# EAGLE schematic Janus v2 (EAGLE 7.4.0)
AUTHOR: Jordan Jones; DESCRIPT: Single Two Input XOR Single One Input NOT 555 Timer Quad Two Input AND; DEVICE: CAPACITOR CAPACITOR 1N4148X-TP TLP152 TLP152 TLP152 DMN6140L-7 DMN6140L-7 RESISTOR RESISTOR RESISTOR RESISTOR 74LVC1G86W5-7 74HCT1G14GW,125 NE555S-13DICT-ND SN74LV08APWR; DOCNUM: 1; ORGANIZATION: CAL POLY IGVC; PACKAGE: C0603 C0603 SOD523_SC79 SOIC-6-5 SOIC-6-5 SOIC-6-5 SOT-23 SOT-23 R0603 R0603 R0603 R0603 SOT-25 SOT-353 SO-8 TSSOP-14; PARTS: C1 C2 D1 OK1 OK2 OK3 Q1 Q2 R1 R2 R3 R4 U1 U2 U3 U4; PARTVAL: .01uF 100nF 330ohm 330ohm 330ohm 1Mohm; REV: 1.0.1
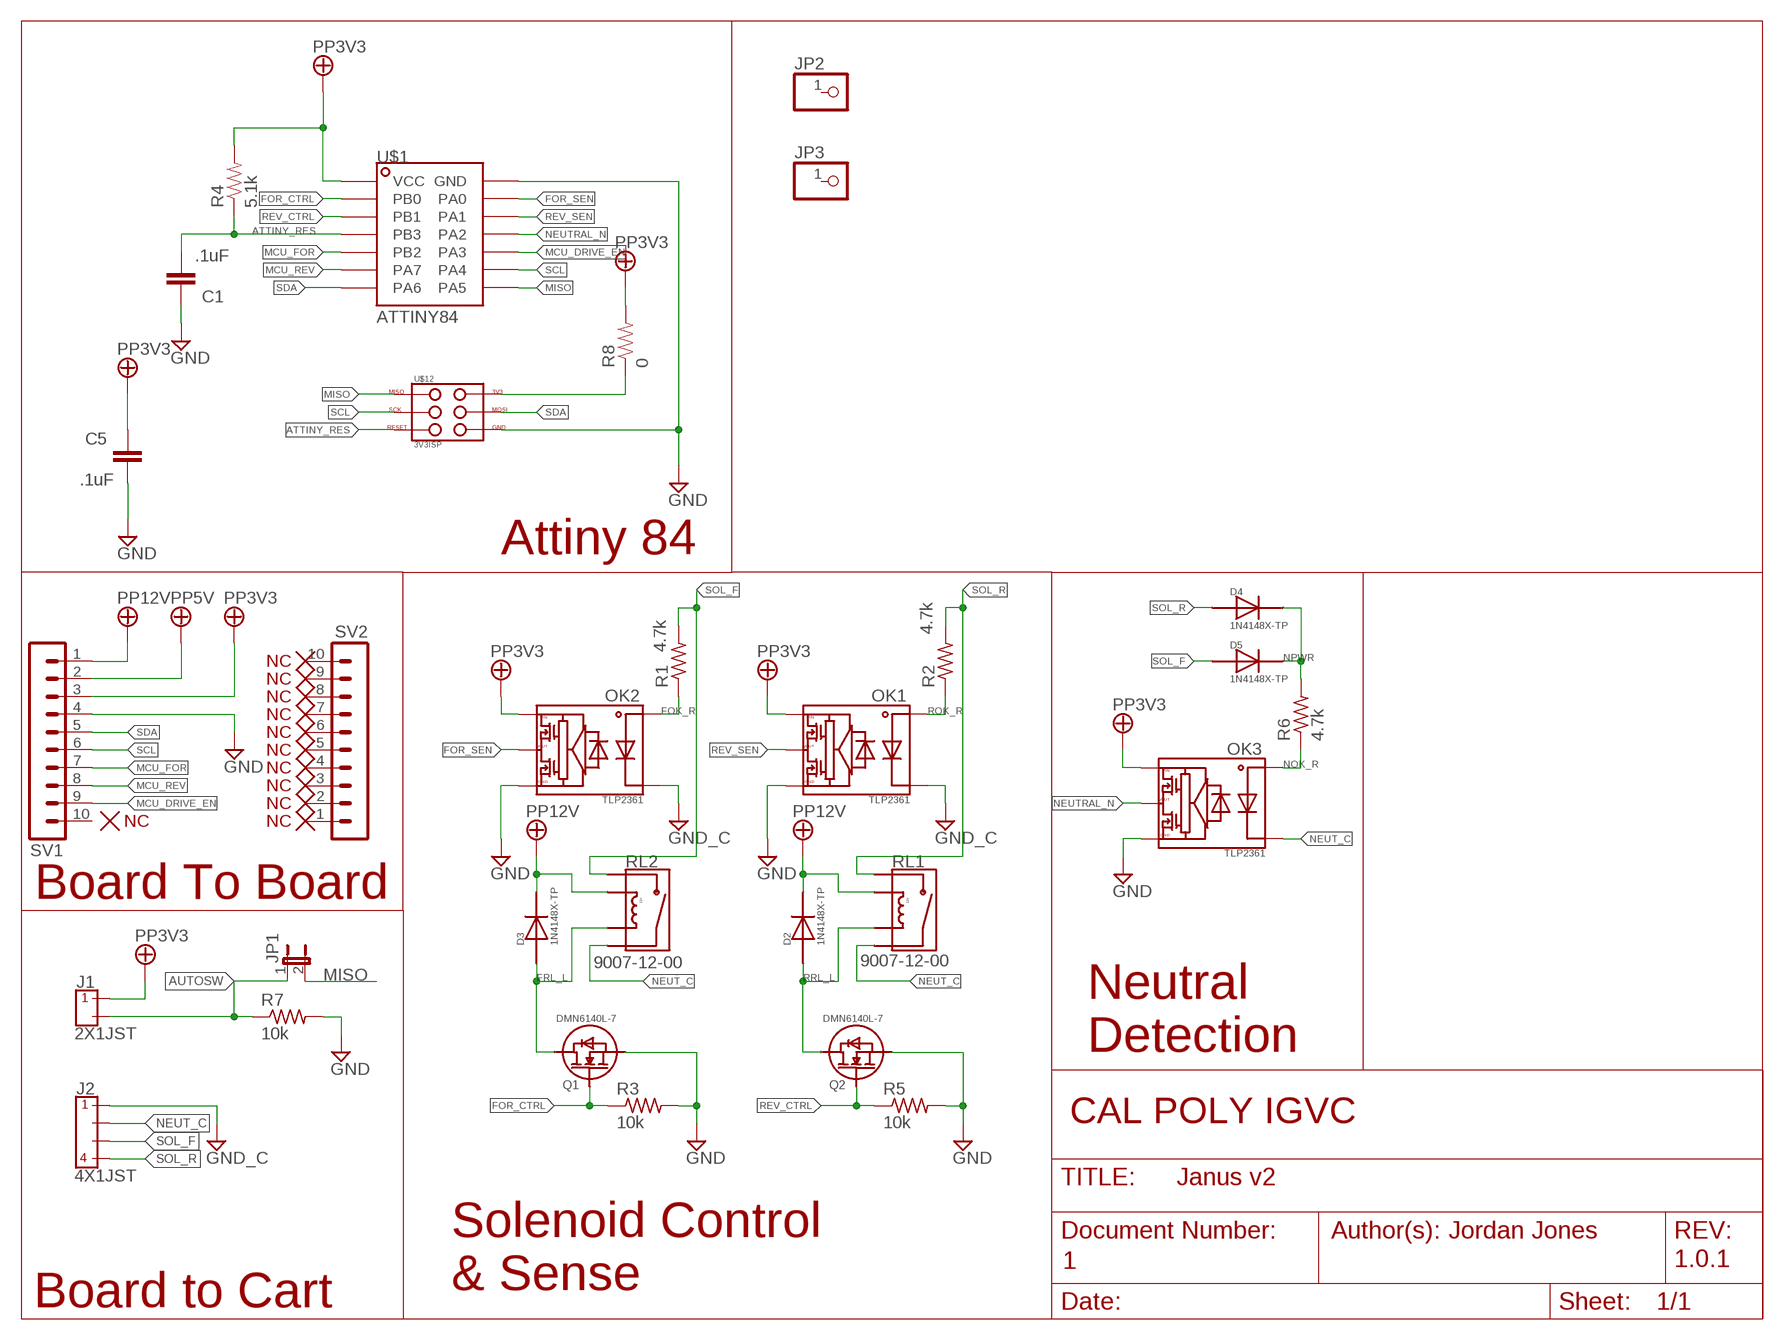
[diagram p0: schematic, sheet 1]

## Parts
C1  .1uF  C-EUC0603  [C0603]
C5  .1uF  C-EUC0603  [C0603]
D2  1N4148X-TP  [SOD523_SC79]
D3  1N4148X-TP  [SOD523_SC79]
D4  1N4148X-TP  [SOD523_SC79]
D5  1N4148X-TP  [SOD523_SC79]
J1  2X1JST  [JST-2-PTH-VERT]
J2  4X1JST  [JST-4-PTH-VERT]
JP1  JP1E  [JP1]
JP2  PINHD-1X1  [1X01]
JP3  PINHD-1X1  [1X01]
OK1  TLP2361  [SOIC-6-5]
OK2  TLP2361  [SOIC-6-5]
OK3  TLP2361  [SOIC-6-5]
Q1  DMN6140L-7  [SOT-23-3]
Q2  DMN6140L-7  [SOT-23-3]
R1  4.7k  R-US_R0805  [R0805]
R2  4.7k  R-US_R0805  [R0805]
R3  10k  R-US_R0603  [R0603]
R4  5.1k  RESISTOR0603  [0603-RES]
R5  10k  R-US_R0603  [R0603]
R6  4.7k  R-US_R0805  [R0805]
R7  10k  R-US_R0603  [R0603]
R8  0  RESISTOR0603  [0603-RES]
RL1  9007-12-00  [RELAY9007]
RL2  9007-12-00  [RELAY9007]
SV1  MA10-1  [MA10-1]
SV2  MA10-1  [MA10-1]
U$1  ATTINY84  [SOIC-14]
U$12  3V3ISP  [3X2SMD]

## Nets
ATTINY_RES: C1.2 R4.1 U$1.P$4(PB3) U$12.P$3
AUTOSW: J1.2 JP1.1 R7.1
FOK_R: OK2.P$1 R1.1
FOR_CTRL: Q1.P$1(G) R3.1 U$1.P$2(PB0)
FOR_SEN: OK2.P$5 U$1.P$13(PA0)
FRL_L: D3.P$1 Q1.P$3(D) RL2.P$3(COILB)
GND: C1.1 C5.2 OK1.P$4 OK2.P$4 OK3.P$4 Q1.P$2(S) Q2.P$2(S) R3.2 R5.2 R7.2 SV1.4 U$1.P$14(GND) U$12.P$4
GND_1: J2.1 OK1.P$3 OK2.P$3 ; supply symbol labelled GND_C
MCU_DRIVE_EN: SV1.9 U$1.P$10(PA3)
MCU_FOR: SV1.7 U$1.P$5(PB2)
MCU_REV: SV1.8 U$1.P$6(PA7)
MISO: JP1.2 U$1.P$8(PA5) U$12.P$1
N$1: R8.1 U$12.P$6
NEUT_C: J2.2 OK3.P$3 RL1.P$4(SIGB) RL2.P$4(SIGB)
NEUTRAL_N: OK3.P$5 U$1.P$11(PA2)
NOK_R: OK3.P$1 R6.1
NPWR: D4.P$2 D5.P$2 R6.2
PP3V3: C5.1 J1.1 OK1.P$6 OK2.P$6 OK3.P$6 R4.2 R8.2 SV1.3 U$1.P$1(VCC)
PP5V: SV1.2
PP12V: D2.P$2 D3.P$2 RL1.P$2(COILA) RL2.P$2(COILA) SV1.1
REV_CTRL: Q2.P$1(G) R5.1 U$1.P$3(PB1)
REV_SEN: OK1.P$5 U$1.P$12(PA1)
ROK_R: OK1.P$1 R2.1
RRL_L: D2.P$1 Q2.P$3(D) RL1.P$3(COILB)
SCL: SV1.6 U$1.P$9(PA4) U$12.P$2
SDA: SV1.5 U$1.P$7(PA6) U$12.P$5
SOL_F: D5.P$1 J2.3 R1.2 RL2.P$1(SIGA)
SOL_R: D4.P$1 J2.4 R2.2 RL1.P$1(SIGA)
Unconnected: JP2.1 JP3.1 SV1.10 SV2.1 SV2.2 SV2.3 SV2.4 SV2.5 SV2.6 SV2.7 SV2.8 SV2.9 SV2.10

## Notes on the sheet
- Attiny 84
- Board To Board
- Neutral
  Detection
- Solenoid Control
  & Sense
- Board to Cart

## Library data of the parts
C1 C5 = resistor:C-EU: CAPACITOR, European symbol
D2-D5 = CP-Discrete:1N4148X-TP: Diode; DIGIKEYPART: 1N4148XTPMSCT-ND
J1 = CP-Connectors:2X1; DIGIKEYPART: 455-1704-ND
J2 = CP-Connectors:4X1; DIGIKEYPART: 455-1706-ND
JP1 = jumper:JP1E: JUMPER
JP2 JP3 = pinhead:PINHD-1X1: PIN HEADER
OK1-OK3 = CP-Discrete:TLP2361: Logic Level Optoisolator Inverts; DIGIKEYPART: TLP2361(TPLECT-ND
Q1 Q2 = CP-Discrete:DMN6140L-7: NMosfet 60V 1.6A 140mOhm @ 10V 700mW; DIGIKEYPART: DMN6140L-7DICT-ND
R1-R3 R5-R7 = resistor:R-US_: RESISTOR, American symbol
R4 R8 = SparkFun-Resistors:RESISTOR: Resistor Basic schematic elements and footprints for 0603, 1206, and PTH resistors.
RL1 RL2 = CP-EletroMech:9007: Relay SPST; COILVOLTAGE: 12v; CURRENT: .5A; DIGIKEYPART: 306-1064-ND
SV1 SV2 = con-lstb:MA10-1: PIN HEADER; OC_FARNELL: unknown; OC_NEWARK: unknown
U$1 = CP-IC:ATTINY84; DIGIKEYPART: ATTINY84A-SSU-ND
U$12 = CP-Connectors:3V3ISP; DIGIKEYPART: WM17457-ND